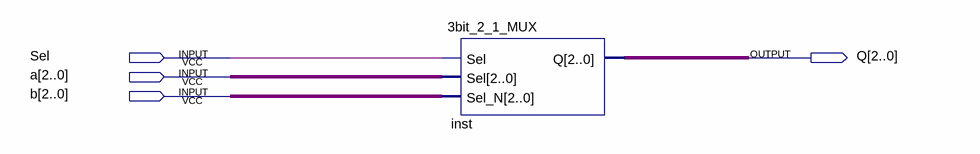
[diagram p0: schematic sheet]
// Quartus schematic test3bitmux.bdf as structural Verilog: 1 symbols, 4 pins
module test3bitmux (
  input  Sel,
  input  [2:0] a,
  input  [2:0] b,
  output [2:0] Q
);

  \3bit_2_1_MUX  inst (.Sel({a[2:1], Sel, a[0]}), .Sel_N(b), .Q(Q));
endmodule
